# Altium schematic sheet Headers and Breakaways.SchDoc
size A; SheetNumber: 5; SheetTotal: 6
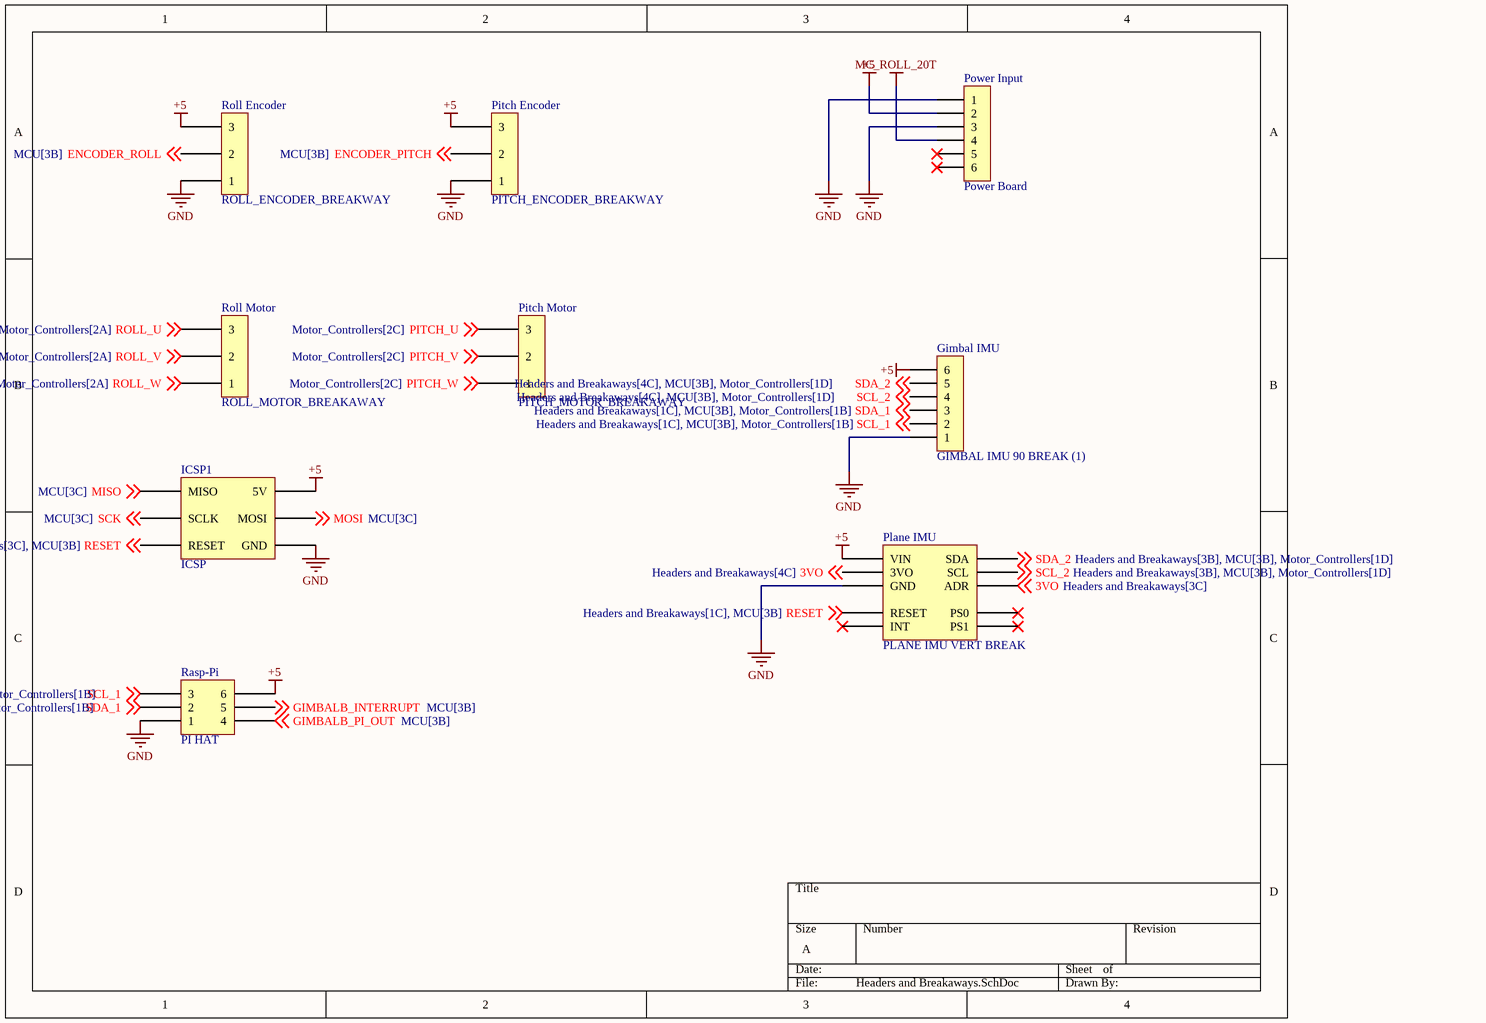
[diagram p0: Headers and Breakaways.SchDoc]

## Parts
Gimbal_IMU  GIMBAL IMU 90 BREAK (1)  [Molex Microfit 3.0 1x6 Right Angle]
ICSP1  ICSP  [2x3 Breakaway Vertical]
Pitch_Encoder  PITCH_ENCODER_BREAKWAY  [1x3 Breakaway Right Angle]
Pitch_Motor  PITCH_MOTOR_BREAKAWAY  [1x3 Breakaway Right Angle]
Plane_IMU  PLANE IMU VERT BREAK  [BNO055 Breakout]
Power_Input  Power Board  [Molex Microfit 3.0 1x6 Right Angle]
Rasp-Pi  PI HAT  [Molex Microfit 3.0 2x3 Right Angle]
Roll_Encoder  ROLL_ENCODER_BREAKWAY  [1x3 Breakaway Right Angle]
Roll_Motor  ROLL_MOTOR_BREAKAWAY  [1x3 Breakaway Right Angle]

## Nets
+5: Gimbal_IMU.6 ICSP1.6(5V) Pitch_Encoder.3 Plane_IMU.6(VIN) Power_Input.2 Rasp-Pi.6 Roll_Encoder.3
GND: Gimbal_IMU.1 ICSP1.4(GND) Pitch_Encoder.1 Plane_IMU.4(GND) Power_Input.1 Power_Input.3 Rasp-Pi.1 Roll_Encoder.1
MC_ROLL_20T: Power_Input.4
3VO: Plane_IMU.5(3VO) Plane_IMU.7(ADR) ; off-sheet 3VO
ENCODER_PITCH: Pitch_Encoder.2 ; off-sheet ENCODER_PITCH
ENCODER_ROLL: Roll_Encoder.2 ; off-sheet ENCODER_ROLL
GIMBALB_INTERRUPT: Rasp-Pi.5 ; off-sheet GIMBALB_INTERRUPT
GIMBALB_PI_OUT: Rasp-Pi.4 ; off-sheet GIMBALB_PI_OUT
MISO: ICSP1.3(MISO) ; off-sheet MISO
MOSI: ICSP1.5(MOSI) ; off-sheet MOSI
PITCH_U: Pitch_Motor.3 ; off-sheet PITCH_U
PITCH_V: Pitch_Motor.2 ; off-sheet PITCH_V
PITCH_W: Pitch_Motor.1 ; off-sheet PITCH_W
RESET: ICSP1.1(RESET) Plane_IMU.1(RESET) ; off-sheet RESET
ROLL_U: Roll_Motor.3 ; off-sheet ROLL_U
ROLL_V: Roll_Motor.2 ; off-sheet ROLL_V
ROLL_W: Roll_Motor.1 ; off-sheet ROLL_W
SCK: ICSP1.2(SCLK) ; off-sheet SCK
SCL_1: Gimbal_IMU.2 Rasp-Pi.3 ; off-sheet SCL_1
SCL_2: Gimbal_IMU.4 Plane_IMU.2(SCL) ; off-sheet SCL_2
SDA_1: Gimbal_IMU.3 Rasp-Pi.2 ; off-sheet SDA_1
SDA_2: Gimbal_IMU.5 Plane_IMU.3(SDA) ; off-sheet SDA_2

Not connected (* = marked no-connect by the designer): Plane_IMU 8(INT)* 9(PS1)* 10(PS0)*; Power_Input 5* 6*

## Library data of the parts
Gimbal_IMU = Molex Microfit 3.0 1x6 Right Angle: 3.00mm Pitch Micro-Fit 3.0 Header, Surface Mount Compatible, Single Row, Right Angle, with Snap-in Plastic Peg PCB Lock, 6 Circuits, Tin (Sn) Plating, Glow Wire Compatible; MF: Molex; MP: 43650-0600; Value: 1x6 Breakaway; Package: None; SnapEDA_Link: https://www.snapeda.com/parts/43650-0600/Molex/view-part/?ref=snap; Purchase-URL: https://pricing.snapeda.com/search/part/43650-0600/?ref=eda; Check_prices: https://www.snapeda.com/parts/43650-0600/Molex/view-part/?ref=eda; Price: None; Availability: In Stock
Pitch_Encoder Pitch_Motor Roll_Encoder Roll_Motor = 1x3 Right Angle Breakaway: MPN: 5-104935-3; Manufacturer: TE; DNI: DNI; DNP: DNP
Plane_IMU = BNO055 Breakout: Adafruit BNO055 Breakout Board Mount FRONT SIDE UP; MPN: 2472; Manufacturer: Adafruit; DNI: DNI; DNP: DNP
Power_Input = Molex Microfit 3.0 1x6 Right Angle: 3.00mm Pitch Micro-Fit 3.0 Header, Surface Mount Compatible, Single Row, Right Angle, with Snap-in Plastic Peg PCB Lock, 6 Circuits, Tin (Sn) Plating, Glow Wire Compatible; MF: Molex; MP: 43650-0600; Value: Molex 1x6 Right Angle; Package: None; SnapEDA_Link: https://www.snapeda.com/parts/43650-0600/Molex/view-part/?ref=snap; Purchase-URL: https://pricing.snapeda.com/search/part/43650-0600/?ref=eda; Check_prices: https://www.snapeda.com/parts/43650-0600/Molex/view-part/?ref=eda; Price: None; Availability: In Stock; DNI: DNI; DNP: DNP
Rasp-Pi = Molex Microfit 3.0 2x3 Right Angle: MPN: 0430450601; Value: Molex 2x3 Right Angle; DNI: DNI; DNP: DNP
ICSP1 = ICSP: DNI: DNI; DNP: DNP